# EAGLE design RPi_ADC_hat (EAGLE 6.4)

## Sheet 1 of 2
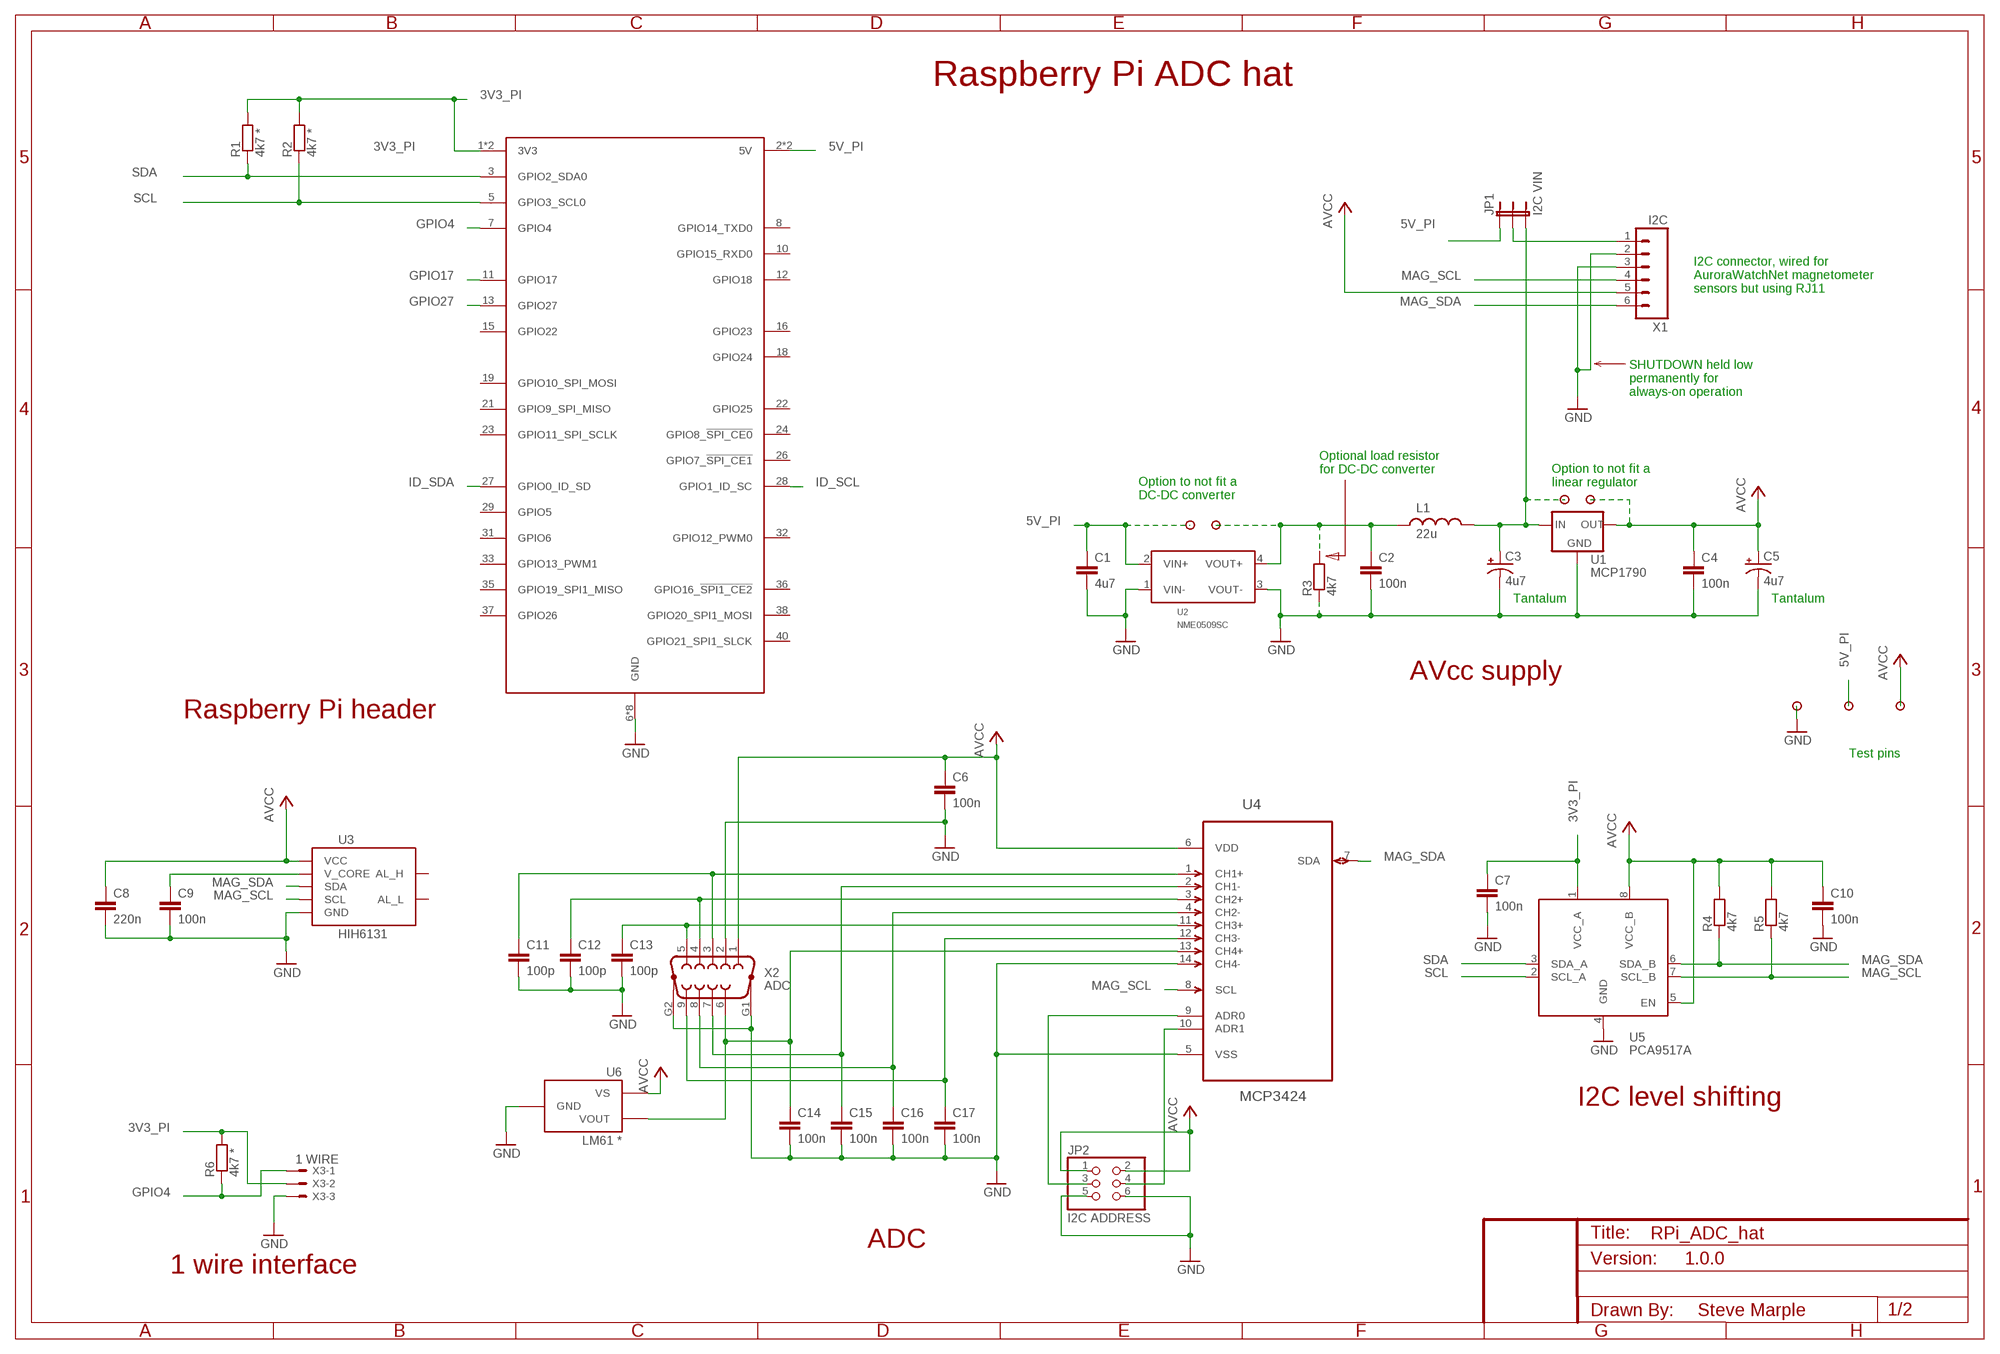
[diagram p0: schematic, sheet 1]

### Parts
C1  4u7  C-EU1206-HAND  [1206-HAND]
C2  100n  C-EU1206-HAND  [1206-HAND]
C3  4u7  CAP_POL1210-HAND  [CPOL-1210-HAND]
C4  100n  C-EU1206-HAND  [1206-HAND]
C5  4u7  CAP_POL1210-HAND  [CPOL-1210-HAND]
C6  100n  C-EU1206-HAND  [1206-HAND]
C7  100n  C-EU1206-HAND  [1206-HAND]
C8  220n  C-EU1206-HAND  [1206-HAND]
C9  100n  C-EU1206-HAND  [1206-HAND]
C10  100n  C-EU1206-HAND  [1206-HAND]
C11  100p  C-EU1206-HAND  [1206-HAND]
C12  100p  C-EU1206-HAND  [1206-HAND]
C13  100p  C-EU1206-HAND  [1206-HAND]
C14  100n  C-EU1206-HAND  [1206-HAND]
C15  100n  C-EU1206-HAND  [1206-HAND]
C16  100n  C-EU1206-HAND  [1206-HAND]
C17  100n  C-EU1206-HAND  [1206-HAND]
JP1  I2C VIN  JUMPER-3PTH  [1X03]
JP2  I2C ADDRESS  PINHD-2X3  [2X03]
L1  22u  INDUCTOR1210-HAND  [1210-HAND]
R1  4k7 *  RESISTOR1206-HAND  [1206-HAND]
R2  4k7 *  RESISTOR1206-HAND  [1206-HAND]
R3  4k7  RESISTOR1210-HAND  [1210-HAND]
R4  4k7  RESISTOR1206-HAND  [1206-HAND]
R5  4k7  RESISTOR1206-HAND  [1206-HAND]
R6  4k7 *  RESISTOR1206-HAND  [1206-HAND]
U1  MCP1790  TC1262SOT223-HAND  [SOT223-HAND]
U2  NME0509SC  DC-DC-CONV-4PIN-ISOLATINGMURATA-NME-05-12-SERIES  [DC-DC-MURATA-NME-05-12-SERIES]
U3  HIH6131  HONEYWELL-HIH613XSOIC8  [SO08]
U4  MCP3424  MCP3424-E/SLSO14  [SO14]
U5  PCA9517A  PCA9517ASOIC  [SO08]
U6  LM61 *  LM61SOT23  [SOT23-3-HAND]
U$1  PCB  RASPBERRY-PI-3  [RASPBERRY-PI-3]
U$2  PAD  [PAD]
U$3  PAD  [PAD]
U$4  PAD  [PAD]
U$5  PAD  [PAD]
U$6  PAD  [PAD]
U$7  PAD  [PAD]
U$8  PAD  [PAD]
X1  I2C  RJ11-6PTH  [RJ11-6]
X2  ADC  CONN-D9-FEMALEMULTICOMP-5504F1  [DSUB-5504F1-02-9PIN]
X3  1 WIRE  22-23-2031  [22-23-2031]

### Nets
3V3_PI [power]: C7.1 R1.2 R2.2 R6.2 U5.1(VCC_A) U$1.1(3V3) U$1.17(3V3) X3.2 ; also sheet 2
5V_PI [power]: C1.1 JP1.1 U2.2(VIN+) U$1.2(5V) U$1.4(5V) U$4.1 U$7.1 ; also sheet 2
AVCC [power]: C4.1 C5.+ C6.1 C8.1 C10.1 JP2.1 JP2.2 R4.2 R5.2 U1.3(OUT) U3.8(VCC) U4.6(VDD) U5.5(EN) U5.8(VCC_B) U6.1(VS) U$3.1 U$8.1 X1.5 X2.1
CH1+: C11.1 U4.1(CH1+) X2.3
CH1-: C15.1 U4.2(CH1-) X2.7
CH2+: C12.1 U4.3(CH2+) X2.4
CH2-: C16.1 U4.4(CH2-) X2.8
CH3+: C13.1 U4.11(CH3+) X2.5
CH3-: C17.1 U4.12(CH3-) X2.9
CH4+: C14.1 U4.13(CH4+) U6.2(VOUT) X2.6
DC-DC_OUT [power]: C3.+ JP1.3 L1.2 U1.1(IN) U$2.1
DC-DC_UNFILTERED [power]: C2.1 L1.1 R3.2 U2.4(VOUT+) U$5.1
GND [power]: C1.2 C2.2 C3.- C4.2 C5.- C6.2 C7.2 C8.2 C9.2 C10.2 C11.2 C12.2 C13.2 C14.2 C15.2 C16.2 C17.2 JP2.5 JP2.6 R3.1 U1.2(GND) U1.4(GND) U2.1(VIN-) U2.3(VOUT-) U3.2(GND) U4.5(VSS) U4.14(CH4-) U5.4(GND) U6.3(GND) U$1.6(GND) U$1.9(GND) U$1.14(GND) U$1.20(GND) U$1.25(GND) U$1.30(GND) U$1.34(GND) U$1.39(GND) U$6.1 X1.2 X1.3 X2.2 X2.G1 X2.G2 X3.3 ; also sheet 2
GPIO4: R6.1 U$1.7(GPIO4) X3.1
GPIO17: U$1.11(GPIO17) ; also sheet 2
GPIO27: U$1.13(GPIO27) ; also sheet 2
HIH_VCORE [power]: C9.1 U3.1(V_CORE)
I2C_VIN [power]: JP1.2 X1.1
ID_SCL: U$1.28(GPIO1_ID_SC) ; also sheet 2
ID_SDA: U$1.27(GPIO0_ID_SD) ; also sheet 2
MAG_SCL: R5.1 U3.3(SCL) U4.8(SCL) U5.7(SCL_B) X1.4
MAG_SDA: R4.1 U3.4(SDA) U4.7(SDA) U5.6(SDA_B) X1.6
N$6: JP2.3 U4.9(ADR0)
N$16: JP2.4 U4.10(ADR1)
SCL: R2.1 U5.2(SCL_A) U$1.5(GPIO3_SCL0)
SDA: R1.1 U5.3(SDA_A) U$1.3(GPIO2_SDA0)
Unconnected: U3.5(AL_H) U3.6(AL_L) U$1.8(GPIO14_TXD0) U$1.10(GPIO15_RXD0) U$1.12(GPIO18) U$1.15(GPIO22) U$1.16(GPIO23) U$1.18(GPIO24) U$1.19(GPIO10_SPI_MOSI) U$1.21(GPIO9_SPI_MISO) U$1.22(GPIO25) U$1.23(GPIO11_SPI_SCLK) U$1.24(GPIO8_!SPI_CE0) U$1.26(GPIO7_!SPI_CE1) U$1.29(GPIO5) U$1.31(GPIO6) U$1.32(GPIO12_PWM0) U$1.33(GPIO13_PWM1) U$1.35(GPIO19_SPI1_MISO) U$1.36(GPIO16_!SPI1_CE2) U$1.37(GPIO26) U$1.38(GPIO20_SPI1_MOSI) U$1.40(GPIO21_SPI1_SLCK)

### Notes on the sheet
- Raspberry Pi ADC hat
- I2C connector, wired for
  AuroraWatchNet magnetometer
  sensors but using RJ11
- SHUTDOWN held low
  permanently for 
  always-on operation
- Optional load resistor
  for DC-DC converter
- Option to not fit a
  linear regulator
- Option to not fit a
  DC-DC converter
- Tantalum | Tantalum
- AVcc supply
- Raspberry Pi header
- Test pins
- I2C level shifting
- ADC
- 1.0.0
- 1 wire interface
- Steve Marple

## Sheet 2 of 2
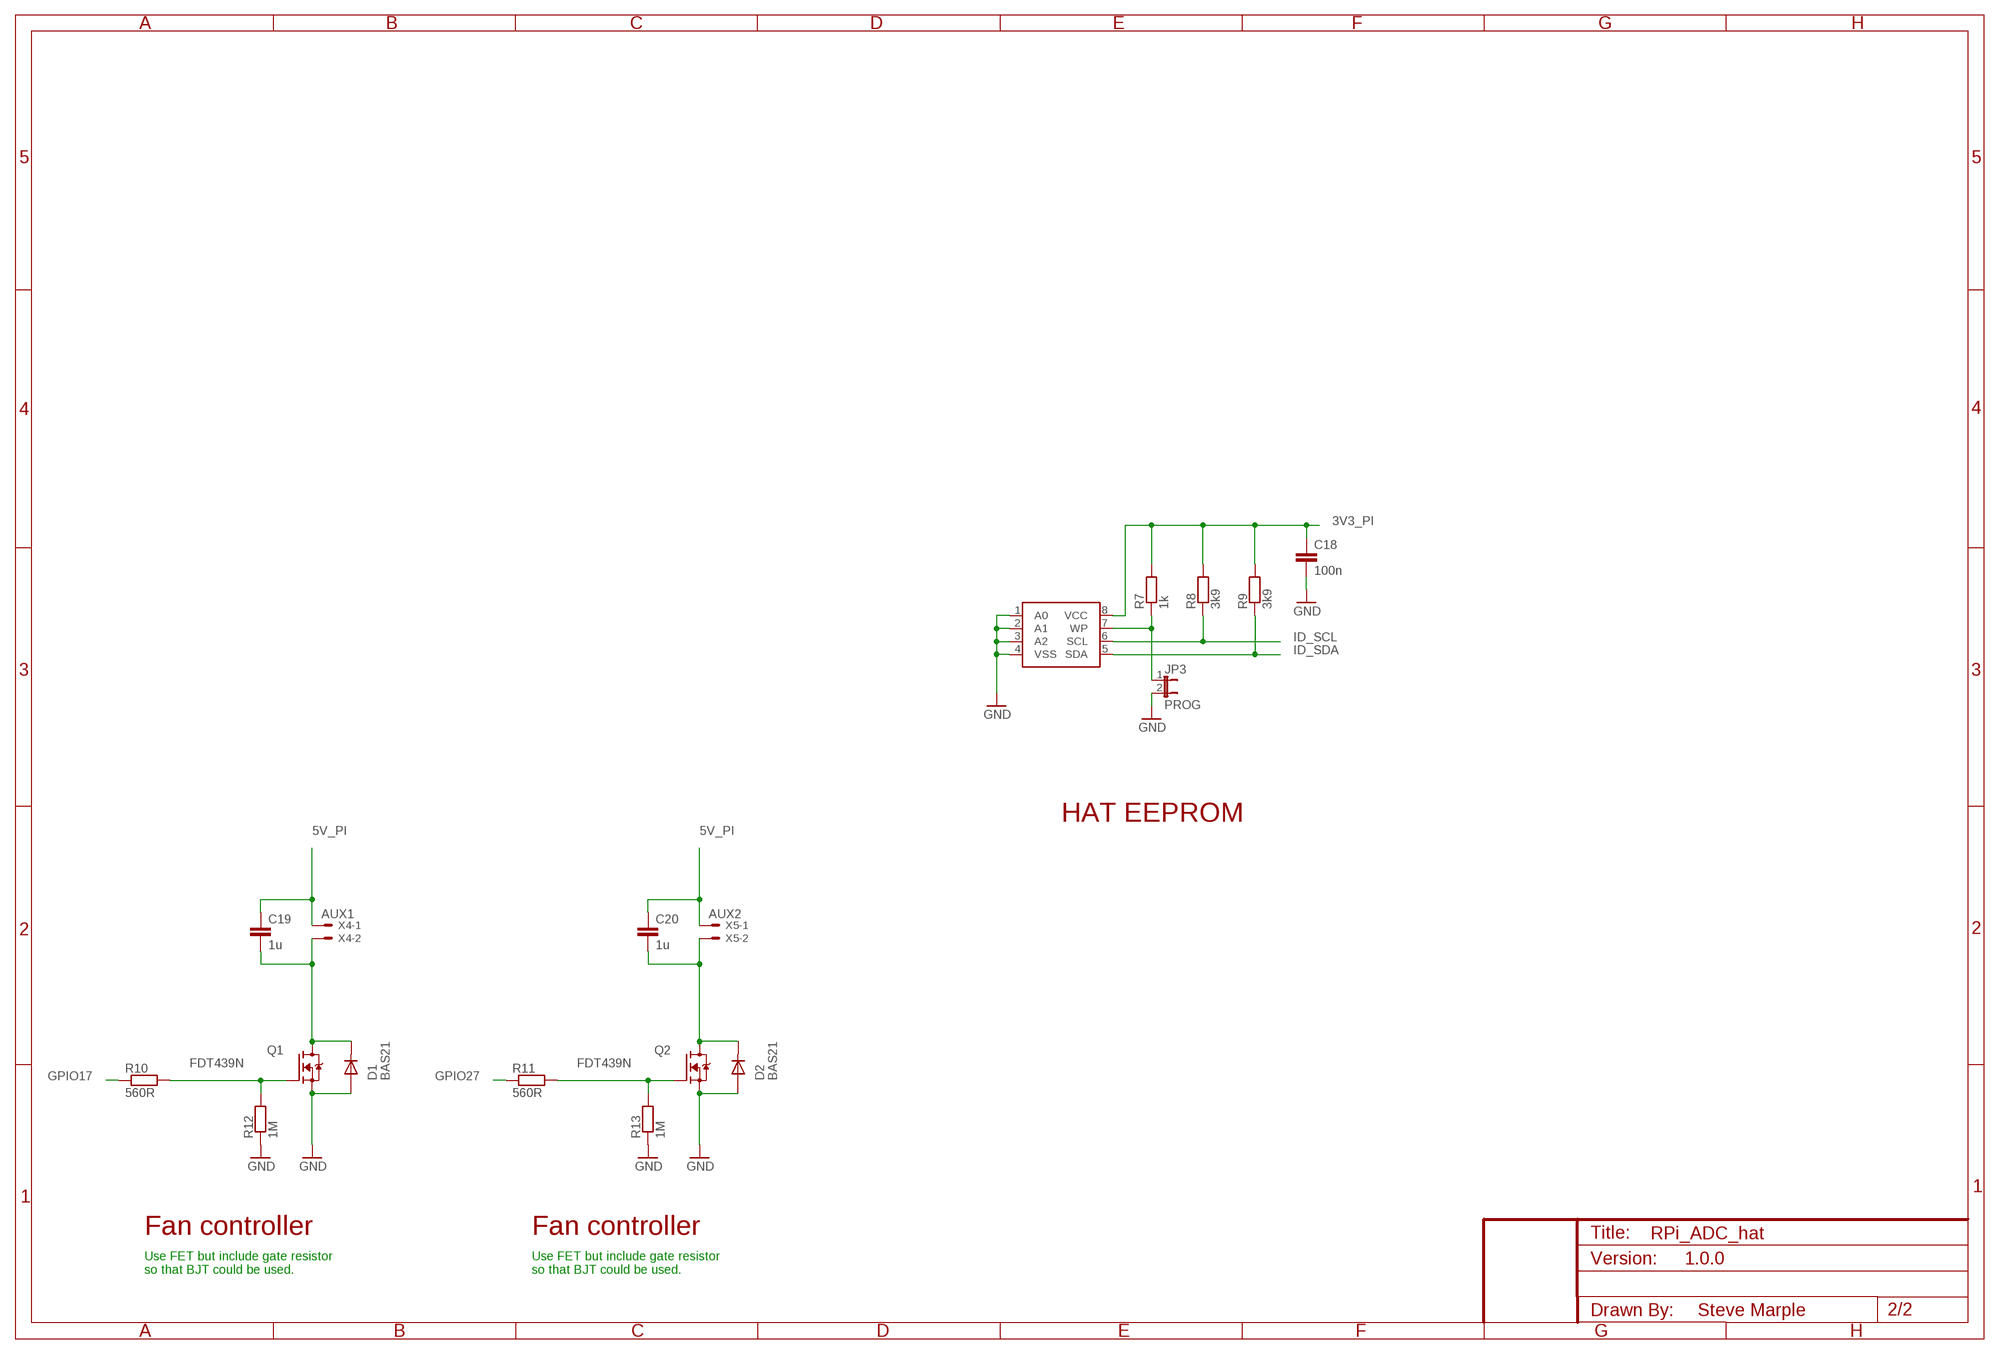
[diagram p1: schematic, sheet 2]

### Parts
C18  100n  C-EU1206-HAND  [1206-HAND]
C19  1u  C-EU1206-HAND  [1206-HAND]
C20  1u  C-EU1206-HAND  [1206-HAND]
D1  BAS21  DIODESOT23-1-3-HAND  [SOT23-3-HAND]
D2  BAS21  DIODESOT23-1-3-HAND  [SOT23-3-HAND]
JP3  PROG  JUMPER-2PTH  [1X02]
Q1  FDT439N  FET-N-TYPESOT223-HAND  [SOT223-HAND]
Q2  FDT439N  FET-N-TYPESOT223-HAND  [SOT223-HAND]
R7  1k  RESISTOR1206-HAND  [1206-HAND]
R8  3k9  RESISTOR1206-HAND  [1206-HAND]
R9  3k9  RESISTOR1206-HAND  [1206-HAND]
R10  560R  RESISTOR1206-HAND  [1206-HAND]
R11  560R  RESISTOR1206-HAND  [1206-HAND]
R12  1M  RESISTOR1206-HAND  [1206-HAND]
R13  1M  RESISTOR1206-HAND  [1206-HAND]
U7  C24C32  EEPROM-C24CXXSOIC8  [SO08]
X4  AUX1  22-23-2021  [22-23-2021]
X5  AUX2  22-23-2021  [22-23-2021]

### Nets
3V3_PI [power]: C18.1 R7.2 R8.2 R9.2 U7.8(VCC) ; also sheet 1
5V_PI [power]: C19.1 C20.1 X4.1 X5.1 ; also sheet 1
EEPROM_WP: JP3.1 R7.1 U7.7(WP)
FAN1_CTRL [power]: C19.2 D1.3(C) Q1.2(D) Q1.4(D) X4.2
FAN2_CTRL [power]: C20.2 D2.3(C) Q2.2(D) Q2.4(D) X5.2
GND [power]: C18.2 D1.1(A) D2.1(A) JP3.2 Q1.3(S) Q2.3(S) R12.1 R13.1 U7.1(A0) U7.2(A1) U7.3(A2) U7.4(VSS) ; also sheet 1
GPIO17: R10.1 ; also sheet 1
GPIO27: R11.1 ; also sheet 1
ID_SCL: R8.1 U7.6(SCL) ; also sheet 1
ID_SDA: R9.1 U7.5(SDA) ; also sheet 1
N$3: Q2.1(G) R11.2 R13.2
N$29: Q1.1(G) R10.2 R12.2

### Notes on the sheet
- HAT EEPROM
- Fan controller | Fan controller
- 1.0.0
- Use FET but include gate resistor
  so that BJT could be used.
- Use FET but include gate resistor
  so that BJT could be used.
- Steve Marple

## Library data of the parts
C1 C2 C4 C6-C20 = SteveMarple:C-EU
C3 C5 = SteveMarple:CAP_POL: Capacitor Polarized These are standard SMD and PTH capacitors. Normally 10uF, 47uF, and 100uF in electrolytic and tantalum varieties. Always verify the external diameter of the through hole cap, it varies with capacity, voltage, and manufacturer. The EIA devices should be standard.
D1 D2 = SteveMarple:DIODE
JP1 = SparkFun:JUMPER-3
JP2 = pinhead:PINHD-2X3: PIN HEADER
JP3 = SparkFun:JUMPER-2: Jumper Basic 0.1" spaced jumper. Use with breakaway headers.
L1 = SteveMarple:INDUCTOR: Inductors Basic Inductor/Choke - 0603 and 1206. Footprints are not proven and vary greatly between part numbers.
Q1 Q2 = SteveMarple:FET-N-TYPE
R1-R13 = SteveMarple:RESISTOR: 1/4W PTH resistor
U1 = SteveMarple:TC1262: Micropchip TC1262 CMOS LDO 500mA. 80uA supply current.
U2 = SteveMarple:DC-DC-CONV-4PIN-ISOLATING
U3 = SteveMarple:HONEYWELL-HIH613X
U4 = SteveMarple:MCP3424-E/SL: Analog-to-Digital Converter Footprint adapted from Eagle file from Onecall web site
U5 = SteveMarple:PCA9517A
U6 = SteveMarple:LM61
U7 = SteveMarple:EEPROM-C24CXX
U$1 = SteveMarple:RASPBERRY-PI-3
U$2-U$8 = SteveMarple:PAD
X1 = SteveMarple:RJ11-6: RJ11 Jack Simple 6 pin RJ11 jack. Commonly found on CAT3 devices and Microchip programmers. SKU: PRT-00132
X2 = SteveMarple:CONN-D9-FEMALE: SUB-D; OC_FARNELL: unknown; OC_NEWARK: unknown
X3 = SteveMarple:22-23-2031: .100" (2.54mm) Center Header - 3 Pin; MF: MOLEX; MPN: 22-23-2031; OC_FARNELL: 1462950; OC_NEWARK: 30C0862
X4 X5 = SteveMarple:22-23-2021: .100" (2.54mm) Center Header - 2 Pin; MF: MOLEX; MPN: 22-23-2021; OC_FARNELL: 1462926; OC_NEWARK: 25C3832

## Net classes
1 power: width 0.381 mm
2 5V: width 0.381 mm
3 antenna: width 0.61 mm

## Board
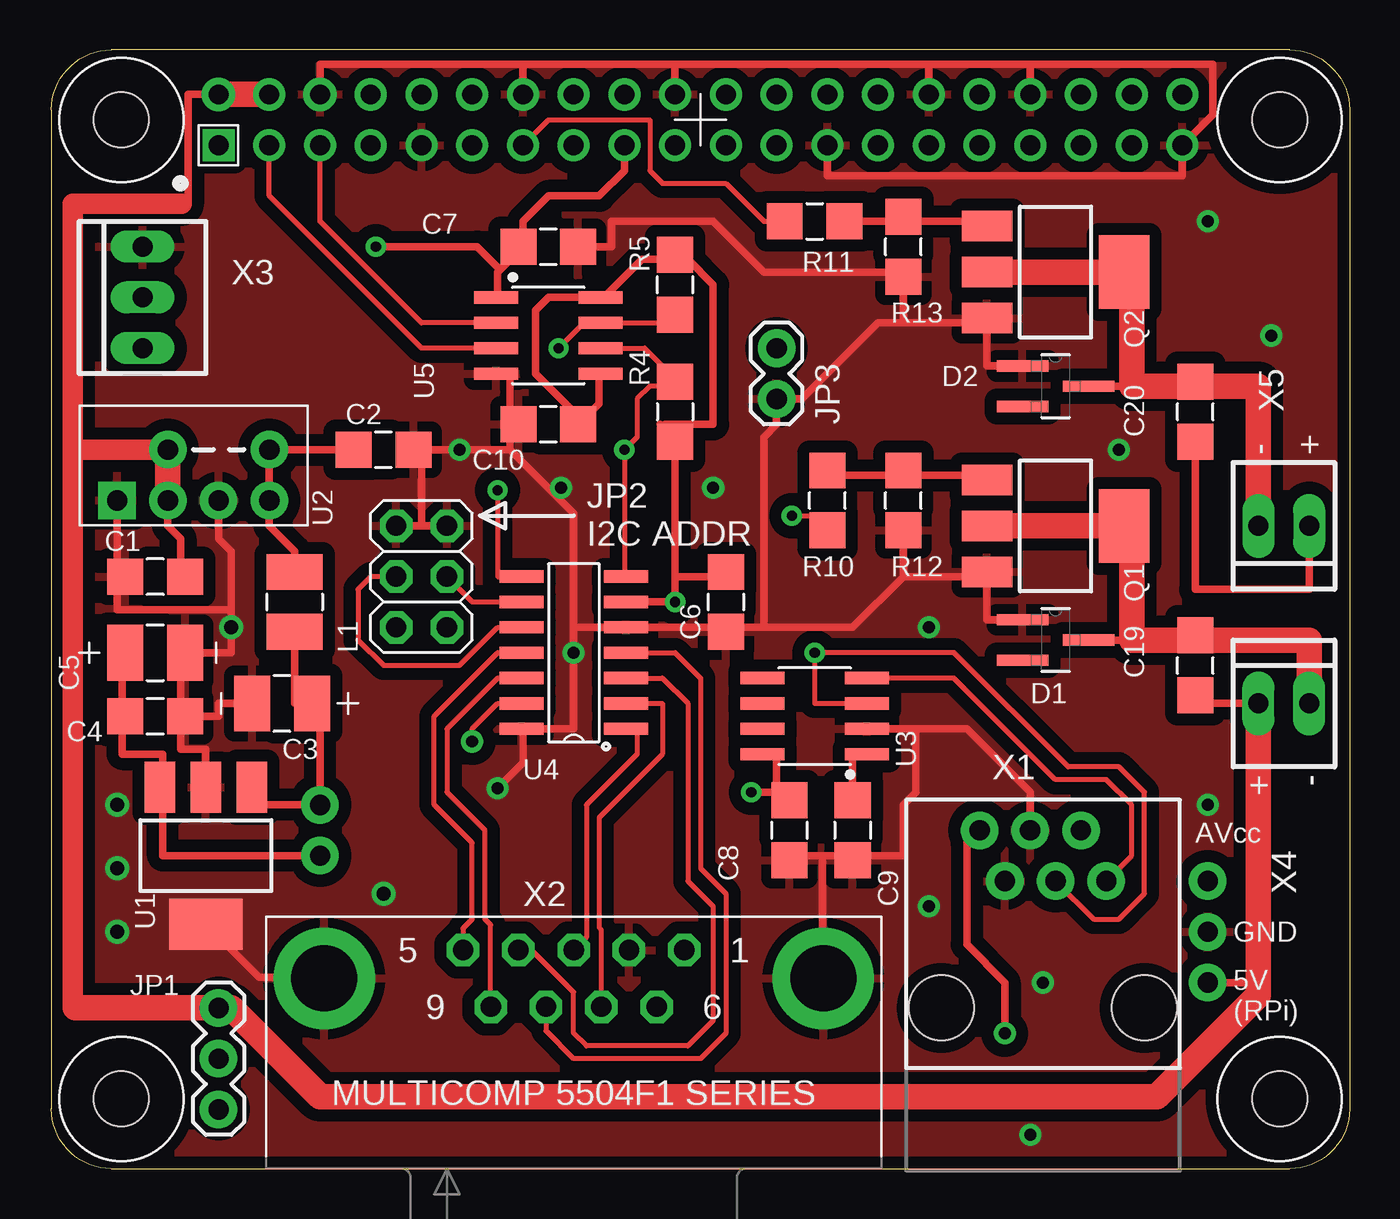
[diagram p2: board, top side]
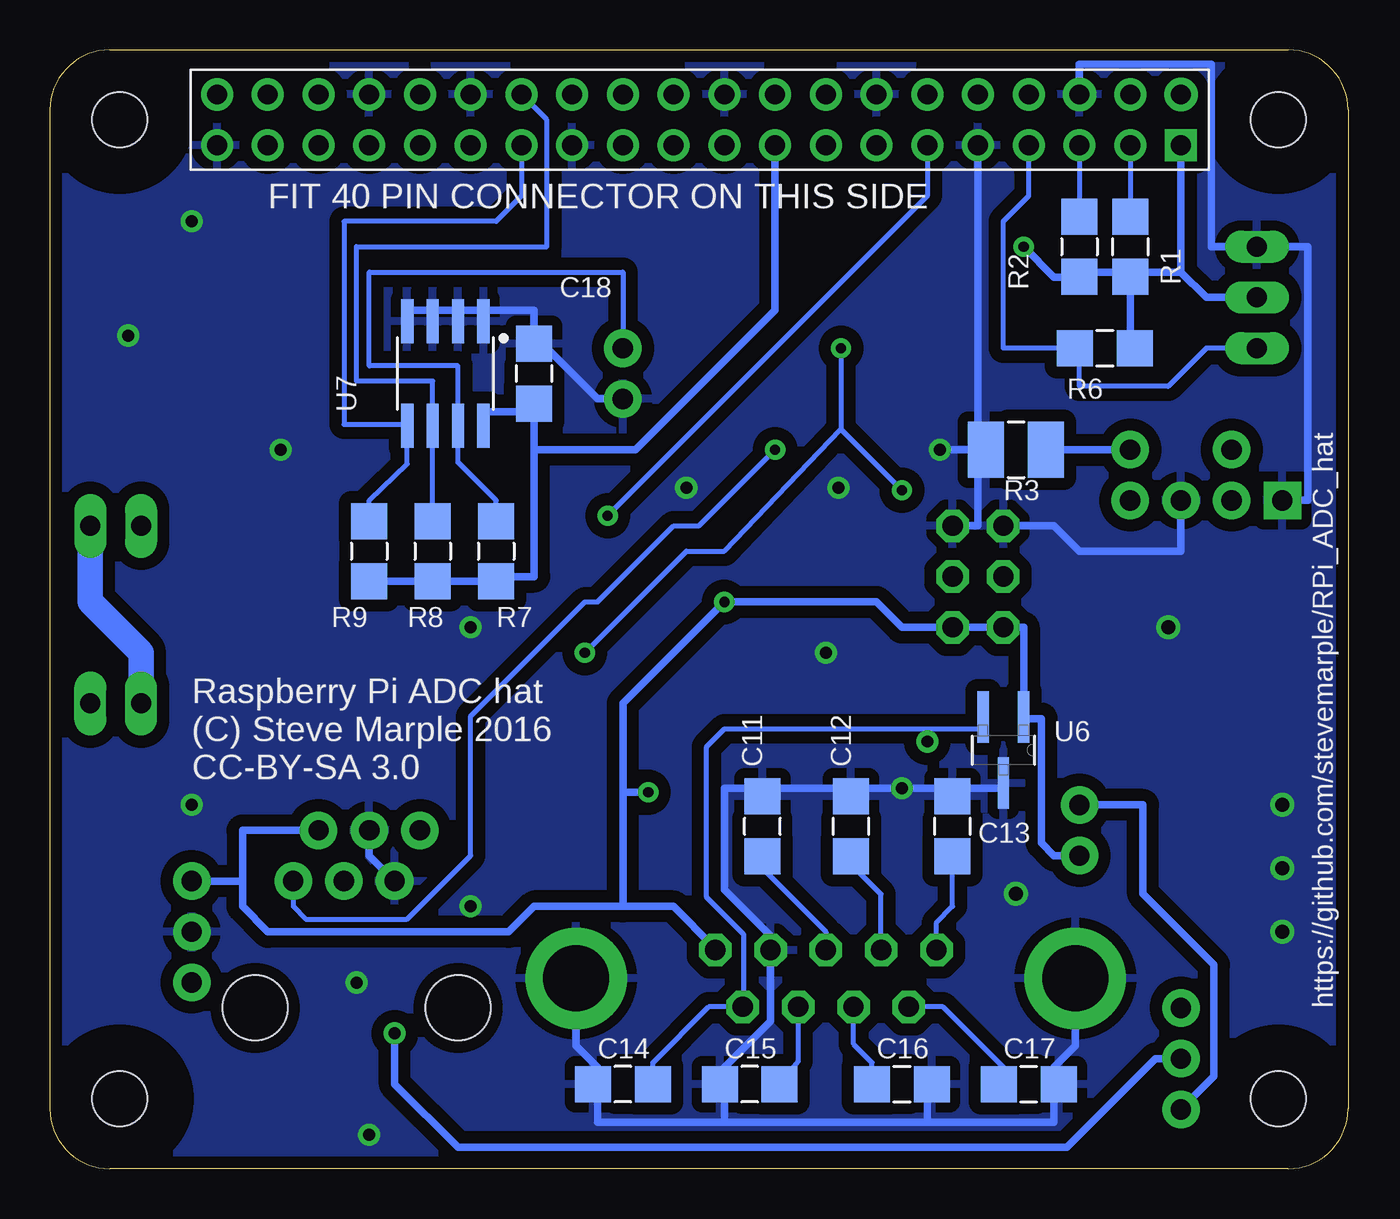
[diagram p3: board, bottom side, seen from below]

Size 65 x 56 mm. Coordinates in mm from the lower left corner, seen from the top.
Copper layers (1*16): Top 0.035mm / dielectric 1.5mm / Bottom 0.035mm
Design rules "SparkFun_Iteadstudio_10_12mil": minimum track width 10mil, minimum drill 20mil, track to track 12mil, track to pad 12mil, pad to pad 12mil, via to via 12mil, smd to smd 12mil, copper to edge 0.5mm, drill to drill 8mil, minimum pad ring 12mil, minimum via ring 10mil, stop-mask expansion 4mil, vias tented up to drill 25mil, thermal gap 20mil

### Footprints (pad centres in the part's own frame; a part is rotated, then mirrored left to right if it is on the bottom)
1206-HAND = smd 1.8 x 1.803: 1 -1.499,0; 2 1.499,0
CPOL-1210-HAND = smd 1.8 x 2.794: + -1.499,0; - 1.499,0
SOT23-3-HAND = smd 2.591 x 0.559: 1 -1.651,1.016; 2 -1.651,-1.016; 3 1.651,0
1X03 = drill 1.016 pad 1.88: 1 0,0; 2 2.54,0; 3 5.08,0
2X03 = drill 1.016 octagon: 1 -2.54,-1.27; 2 -2.54,1.27; 3 0,-1.27; 4 0,1.27; 5 2.54,-1.27; 6 2.54,1.27
1X02 = drill 1.016 pad 1.88: 1 0,0; 2 2.54,0
1210-HAND = smd 1.8 x 2.794: 1 -1.499,0; 2 1.499,0
SOT223-HAND = smd 1.524 x 2.54: 1 -2.3,-3.429; 2 0,-3.429; 3 2.3,-3.429 | smd 3.683 x 2.54: 4 0,3.429
DC-DC-MURATA-NME-05-12-SERIES = drill 1.016 pad 1.88 square: 1 -3.81,0 | drill 1.016 pad 1.88: 2 -1.27,0; 3 1.27,0; 4 3.81,0
SO08 = smd 0.61 x 2.21: 1 -1.905,-2.616; 2 -0.635,-2.616; 3 0.635,-2.616; 4 1.905,-2.616; 5 1.905,2.616; 6 0.635,2.616; 7 -0.635,2.616; 8 -1.905,2.616
SO14 = smd 0.61 x 2.21: 1 -3.81,-2.616; 2 -2.54,-2.616; 3 -1.27,-2.616; 4 0,-2.616; 5 1.27,-2.616; 6 2.54,-2.616; 7 3.81,-2.616; 8 3.81,2.616; 9 2.54,2.616; 10 1.27,2.616; 11 0,2.616; 12 -1.27,2.616; 13 -2.54,2.616; 14 -3.81,2.616
RASPBERRY-PI-3 = drill 1 square: 1 8.37,51.23 | drill 1 pad 1.676: 2 8.37,53.77; 6 13.45,53.77 | drill 1: 3 10.91,51.23; 4 10.91,53.77; 5 13.45,51.23; 7 15.99,51.23; 8 15.99,53.77; 9 18.53,51.23; 10 18.53,53.77; 11 21.07,51.23; 12 21.07,53.77; 13 23.61,51.23; 14 23.61,53.77; 15 26.15,51.23; 16 26.15,53.77; 17 28.69,51.23; 18 28.69,53.77; 19 31.23,51.23; 20 31.23,53.77; 21 33.77,51.23; 22 33.77,53.77; 23 36.31,51.23; 24 36.31,53.77; 25 38.85,51.23; 26 38.85,53.77; 27 41.39,51.23; 28 41.39,53.77; 29 43.93,51.23; 30 43.93,53.77; 31 46.47,51.23; 32 46.47,53.77; 33 49.01,51.23; 34 49.01,53.77; 35 51.55,51.23; 36 51.55,53.77; 37 54.09,51.23; 38 54.09,53.77; 39 56.63,51.23; 40 56.63,53.77 | hole 2.75: 3.5,3.5; 3.5,52.5; 61.5,52.5; 61.5,3.5
PAD = drill 1.016 pad 1.88: 1 0,0
RJ11-6 = drill 1.016 pad 1.88: 1 1.905,8.89; 2 3.175,6.35; 3 4.445,8.89; 4 5.715,6.35; 5 6.985,8.89; 6 8.255,6.35 | hole 3.251: 0,0; 10.16,0
DSUB-5504F1-02-9PIN = drill 1.016 octagon: 1 -5.54,-1.42; 2 -2.77,-1.42; 3 0,-1.42; 4 2.77,-1.42; 5 5.54,-1.42; 6 -4.155,1.42; 7 -1.385,1.42; 8 1.385,1.42; 9 4.155,1.42 | drill 3.302 pad 5.08: G1 -12.495,0; G2 12.495,0
22-23-2031 = drill 1 long: 1 -2.54,0; 2 0,0; 3 2.54,0
22-23-2021 = drill 1 long: 1 -1.27,0; 2 1.27,0

### Placement (x,y rotation side)
C1  5.2,29.64 180 top
C2  16.62,35.99 0 top
C3  11.54,23.29 180 top
C4  5.2,22.66 0 top
C5  5.2,25.83 0 top
C6  33.77,28.37 270 top
C7  24.88,46.15 0 top
C8  36.95,16.94 270 top
C9  40.12,16.94 270 top
C10  24.88,37.26 180 top
C11  29.32,17.14 90 bottom
C12  24.88,17.14 90 bottom
C13  19.8,17.14 90 bottom
C14  36.31,4.24 180 bottom
C15  29.96,4.24 180 bottom
C16  22.34,4.24 0 bottom
C17  15.99,4.24 0 bottom
C18  40.76,39.8 90 bottom
C19  57.27,25.2 90 top
C20  57.27,37.9 90 top
D1  50.28,26.46 0 top
D2  50.28,39.16 0 top
JP1  8.37,8.05 270 top
JP2  18.53,29.64 90 top
JP3  36.31,41.07 270 top
L1  12.18,28.37 270 top
Q1  50.28,32.18 270 top
Q2  50.28,44.88 270 top
R1  10.91,46.15 270 bottom
R2  13.45,46.15 270 bottom
R3  16.62,35.99 0 bottom
R4  31.23,37.9 270 top
R5  31.23,44.24 90 top
R6  12.18,41.07 0 bottom
R7  42.66,30.91 270 bottom
R8  45.84,30.91 270 bottom
R9  49.01,30.91 270 bottom
R10  38.85,33.45 90 top
R11  38.22,47.42 0 top
R12  42.66,33.45 90 top
R13  42.66,46.15 90 top
U1  7.74,15.67 180 top
U2  7.1,33.45 0 top
U3  38.22,22.66 90 top
U4  26.15,25.83 90 top
U5  24.88,41.7 270 top
U6  17.26,20.95 270 bottom
U7  45.2,39.8 180 bottom
U$1  0,0 0 top
U$2  13.45,18.21 0 top
U$3  13.45,15.67 0 top
U$4  5.83,35.99 0 top
U$5  10.91,35.99 0 top
U$6  57.9,11.86 0 top
U$7  57.9,9.32 0 top
U$8  57.9,14.4 0 top
X1  44.56,8.05 0 top
X2  26.15,9.53 180 top
X3  4.56,43.61 90 top
X4  61.71,23.29 0 top
X5  61.71,32.18 180 top

### Tracks (layer width: path | path; a pad name or v marks a point on that pad's centre or on a via)
3V3_PI  (via drill 0.51)
  Top 0.381: U5.1 22.34,43.61 22.34,44.88 22.47,45.01 | 22.47,45.01 23.61,46.15 C7.1 23.61,46.38 23.61,47.42 24.88,48.69 27.42,48.69 28.69,49.96 U$1.17 | 22.47,45.01 21.32,46.15 v16.24,46.15
  Bottom 0.381: U$1.1 8.37,44.88 | 8.37,44.88 10.91,44.88 | 10.91,44.88 13.45,44.88 R2.2 13.45,44.63 14.72,44.63 v16.24,46.15 | 10.91,44.88 R1.2 10.91,41.07 R6.2 | 8.37,44.88 7.1,43.61 X3.2 | R9.2 R8.2 R7.2 42.66,29.64 40.76,29.64 40.76,35.99 | 40.76,35.99 40.76,37.9 | 40.76,37.9 C18.1 | U7.8 43.3,37.9 40.76,37.9 | U$1.17 28.69,42.98 35.67,35.99 40.76,35.99
5V_PI
  Top 0.381: C19.1 57.27,23.29 X4.1 | C20.1 57.27,29 62.98,29 X5.1 | U$1.2 6.85,53.77 6.85,48.31 6.53,48.31 | 1.07,8.05 1.2,8.05 | U2.2 5.83,32.18 6.46,31.54 6.46,29.64 C1.1 6.59,29.64 | U$7.1 60.44,9.32
  Top 1.016: 6.53,48.31 1.07,48.31 1.07,35.99 | U$4.1 1.07,35.99 | 1.07,8.05 1.07,35.99
  Top 1.27: U$1.4 U$1.2 | 1.2,8.05 JP1.1 9.01,8.05 13.45,3.6 55.36,3.6 60.44,8.69 60.44,9.32 X4.1 | U$4.1 U2.2
  Bottom 1.27: X4.1 60.44,25.83 62.98,28.37 X5.1
AVCC  (via drill 0.51)
  Top 0.381: C6.1 33.77,29.64 31.23,29.64 | 31.23,29.64 v31.23,28.37 U4.6 | U5.5 27.5,39.88 27.42,39.8 27.42,38.3 C10.1 26.15,37.26 26.15,37.9 24.25,39.8 24.25,42.98 24.88,43.61 U5.8 27.67,43.61 29.58,45.52 31.1,45.52 | 3.54,22.66 3.54,25.83 C5.+ | 3.54,22.66 C4.1 3.54,22.53 | 3.54,22.53 3.54,20.75 5.58,20.75 5.58,19.48 U1.3 5.58,18.97 5.58,15.67 U$3.1 | 3.54,22.53 3.54,22.66 | 31.1,45.52 31.23,45.64 R5.2 31.23,45.39 31.1,45.52 | 30.47,37.26 31.23,36.5 R4.2 | 31.23,29.64 R4.2 | 31.1,45.52 31.86,45.52 33.13,44.24 33.13,37.26 30.72,37.26 R4.2 | 36.31,18.84 36.31,20.75 U3.8 | v35.04,18.84 36.31,18.84 | 36.31,18.84 C8.1 36.31,18.21 36.44,18.34
  Bottom 0.381: U$3.1 14.72,15.67 15.36,16.3 15.36,22.53 16.24,22.53 U6.1 16.24,27.1 JP2.2 JP2.1 22.34,27.1 23.61,28.37 v31.23,28.37 36.31,23.29 36.31,18.84 | 36.31,13.13 33.77,13.13 31.74,11.1 X2.1 | 36.31,13.13 36.31,18.84 | X1.5 55.36,16.94 55.36,14.4 | 55.36,14.4 55.36,13.13 54.09,11.86 42.02,11.86 40.76,13.13 36.31,13.13 | v35.04,18.84 36.31,18.84 | 55.36,14.4 U$8.1
CH1+
  Top 0.254: 28.69,22.02 U4.1 29.32,22.02 29.32,20.75 26.79,18.21 26.79,11.58 X2.3
  Bottom 0.254: C11.1 29.32,15.04 26.15,11.86 X2.3
CH1-
  Top 0.254: U4.2 30.59,23.29 30.59,20.75 27.42,17.57 27.42,12.06 27.54,11.95 X2.7
  Bottom 0.254: X2.7 27.54,5.37 C15.1
CH2+
  Top 0.254: U4.3 30.59,24.56 31.86,23.29 31.86,14.4 33.13,13.13 33.13,7.42 31.86,6.14 26.79,6.14 26.15,6.78 26.15,8.84 24.04,10.95 X2.4
  Bottom 0.254: C12.1 24.88,15.24 23.38,13.74 X2.4
CH2-
  Top 0.254: U4.4 31.23,25.83 32.5,24.56 32.5,15.04 33.77,13.77 33.77,6.78 32.5,5.51 26.15,5.51 24.77,6.89 X2.8
  Bottom 0.254: C16.1 23.84,5.31 24.77,6.23 X2.8
CH3+
  Top 0.254: U4.11 22.34,25.83 19.16,22.66 19.16,18.21 21.07,16.3 21.07,12.49 20.61,12.04 X2.5
  Bottom 0.254: X2.5 20.61,12.32 19.8,13.13 C13.1
CH3-
  Top 0.254: U4.12 22.34,24.56 19.8,22.02 19.8,18.84 21.7,16.94 21.7,12.49 22,12.21 X2.9
  Bottom 0.254: C17.1 17.26,4.67 17.26,5.08 20.29,8.11 X2.9
CH4+  (via drill 0.6)
  Top 0.254: v21.07,21.38 21.07,22.02 22.34,23.29 U4.13
  Bottom 0.254: 21.07,22.02 31.23,22.02 32.12,21.13 32.12,13.59 30.27,11.73 30.27,8.11 X2.6 32.02,8.11 34.81,5.31 C14.1 | v21.07,21.38 21.07,22.02 | 21.07,22.02 18.15,22.02 18.15,22.61 U6.2
DC-DC_OUT
  Top 0.381: L1.2 12.18,23.29 C3.+ 13.45,23.29 U$2.1 10.28,18.21 10.15,18.97 U1.1
  Bottom 0.381: JP1.3 6.72,4.62 6.72,10.21 10.28,13.77 10.28,18.21 U$2.1
DC-DC_UNFILTERED
  Top 0.381: R3.2 U$5.1 U2.4 10.91,32.18 12.18,30.91 L1.1
  Bottom 0.381: R3.2 U$5.1
EEPROM_WP
  Bottom 0.254: R7.1 42.66,33.45 44.56,35.35 U7.7 44.56,40.18 49.01,40.18 49.01,44.88 36.31,44.88 JP3.1
FAN1_CTRL
  Top 0.381: 54.09,26.46 D1.3 | Q1.4 54.09,32.18 | C19.2 57.27,26.46
  Top 1.27: 54.09,32.18 54.09,26.46 57.27,26.46 62.98,26.46 X4.2 | Q1.2 Q1.4
FAN2_CTRL
  Top 0.381: Q2.4 54.09,44.88 | 54.09,39.16 D2.3 | 57.27,39.16 C20.2
  Top 1.27: Q2.4 Q2.2 | 54.09,44.88 54.09,39.16 57.27,39.16 60.44,39.16 X5.2
GND  (via drill 0.6, 0.7)
  Top 0.381: 33.77,27.1 U4.5 26.15,27.1 | 22.98,37.26 22.98,39.8 U5.4 | 22.98,37.26 C10.2 23.61,37.26 | 26.15,45.52 26.15,45.92 C7.2 | U4.14 23.61,22.02 | 23.61,22.02 23.61,20.32 v22.34,19.05 | 23.61,22.02 26.15,22.02 26.15,27.1 | Q2.3 47.74,42.34 | 42.66,42.34 R13.1 42.43,44.88 35.67,44.88 33.13,47.42 28.05,47.42 28.05,46.15 C7.2 | 42.66,42.34 46.47,42.34 Q2.3 | D2.1 46.85,40.18 Q2.3 | D1.1 46.85,27.48 Q1.3 46.85,29.64 42.66,29.64 | 42.66,29.64 R12.1 | 43.3,22.02 U3.2 | X1.3 49.01,18.84 45.84,22.02 43.3,22.02 | 40.12,15.67 38.6,15.67 | 38.6,15.67 36.31,15.67 C8.2 | 38.6,15.67 38.6,9.32 X2.G1 | U1.4 7.86,12.11 10.4,9.57 13.45,9.57 X2.G2 | 42.66,29.64 40.12,27.1 35.67,27.1 | 33.77,27.1 35.67,27.1 | 33.77,27.1 C6.2 | 35.67,27.1 35.67,36.62 36.31,37.26 JP3.2 37.58,38.53 41.39,42.34 42.66,42.34 | 43.3,22.02 43.3,18.84 42.66,18.21 42.66,15.67 40.12,15.67 | 40.12,15.67 C9.2 | U$1.25 38.85,49.71 56.63,49.71 U$1.39 58.15,52.75 58.15,55.29 49.01,55.29 | 49.01,55.29 43.93,55.29 | U$1.34 49.01,55.29 | 23.61,55.29 U$1.14 | 31.23,55.29 23.61,55.29 | U$1.20 31.23,55.29 | U$1.6 13.45,55.29 23.61,55.29 | 43.93,55.29 U$1.30 | 31.23,55.29 43.93,55.29 | 18.53,32.18 18.53,35.99 | JP2.5 18.53,32.18 | 18.53,32.18 JP2.6 | 18.53,35.99 22.98,35.99 | R3.1 18.53,35.99 | 22.98,35.99 22.98,37.26 | 7.86,19.23 U1.2 7.74,21 6.46,21 6.46,22.66 | 6.46,22.66 6.46,25.83 C5.- 9.01,25.83 9.01,27.99 | 6.46,22.66 C4.2 8.37,22.66 8.37,23.29 C3.- | 9.01,27.99 9.01,30.91 8.37,31.54 U2.3 | U2.1 3.29,29.64 | 9.01,27.99 3.29,27.99 3.29,29.64 | 3.29,29.64 C1.2 | 26.15,27.1 26.15,32.81 22.98,35.99 | 26.15,46.15 C7.2
  Bottom 0.381: 14.72,4.44 14.72,2.33 21.07,2.33 | 21.07,2.33 31.23,2.33 | 31.23,2.33 31.23,4.22 C15.2 31.46,4.85 28.92,7.39 X2.2 28.92,11.66 31.23,13.97 31.23,19.05 29.32,19.05 | C16.2 21.07,4.44 21.07,2.33 | 31.23,2.33 37.58,2.33 37.58,4.44 | 24.88,19.05 v22.34,19.05 19.8,19.05 | C12.2 24.88,19.05 | 24.88,19.05 29.32,19.05 | 29.32,19.05 C11.2 | C13.2 19.8,19.05 | 19.8,19.05 17.26,19.05 U6.3 | C17.2 14.72,4.44 | 14.72,4.44 14.72,5.08 13.65,6.14 X2.G2 | X2.G1 38.65,6.14 37.58,5.08 37.58,4.44 | 37.58,4.44 C14.2 | X1.2 49.01,15.67 X1.3 | 18.53,35.99 18.53,32.18 JP2.5 | 18.53,35.99 U$1.9 | U2.1 2.02,33.45 2.02,46.15 X3.3 6.85,46.15 6.85,55.29 13.45,55.29 U$1.6 | JP2.6 14.72,32.18 13.45,30.91 8.37,30.91 U2.3 | 43.3,42.98 40.76,42.98 C18.2 40.53,41.07 40.12,41.07 37.58,38.53 JP3.2 | U7.1 43.3,42.98 | 43.3,42.98 44.56,42.98 | 45.84,42.98 44.56,42.98 | 44.56,42.98 U7.2 | U7.4 47.1,42.98 45.84,42.98 | 45.84,42.98 U7.3 | R3.1 18.53,35.99 | 18.53,35.99 v20.43,35.99
  other vias: 26.15,25.83 3.29,18.21 3.29,11.86 16.62,13.77 43.93,27.1 49.65,9.32 57.9,18.21 61.08,41.7 57.9,47.42 25.52,34.09 43.93,13.13 9.01,27.1 3.29,15.04 53.45,35.99 33.13,34.09 49.01,1.7
  pour Top (isolate 0.61, rank 2): 68.06,-3.38 68.06,57.58 -5.6,57.58 -5.6,-3.38
  pour Bottom (isolate 0.61): 70.6,-5.92 70.6,60.12 -4.33,60.12 -4.33,-5.92
GPIO4
  Bottom 0.254: X3.1 7.1,41.07 9.01,39.16 13.45,39.16 13.45,40.84 R6.1 17.26,41.07 17.26,47.42 15.99,48.69 U$1.7
GPIO17  (via drill 0.51)
  Top 0.254: v37.07,32.69 38.34,32.69 38.85,32.18 R10.1
  Bottom 0.254: v37.07,32.69 21.07,48.69 U$1.11
GPIO27
  Top 0.254: R11.1 35.67,47.42 33.77,49.33 30.59,49.33 29.96,49.96 29.96,52.5 24.88,52.5 U$1.13
HIH_VCORE
  Top 0.381: C9.1 40.12,20.75 U3.1
I2C_VIN  (via drill 0.6)
  Top 0.381: X1.1 45.84,16.3 45.84,11.22 47.74,9.32 v47.74,6.78
  Bottom 0.381: JP1.2 9.64,5.51 14.09,1.06 44.56,1.06 47.74,4.24 v47.74,6.78
ID_SCL
  Bottom 0.254: R8.1 U7.6 45.84,39.42 49.65,39.42 49.65,46.15 40.12,46.15 40.12,52.5 U$1.28
ID_SDA
  Bottom 0.254: R9.1 49.01,33.45 47.1,35.28 U7.5 47.1,37.26 50.28,37.26 50.28,47.42 42.66,47.42 41.39,48.69 U$1.27
MAG_SCL  (via drill 0.51)
  Top 0.254: R5.1 31.23,42.59 30.98,42.34 U5.7 26.66,42.34 v25.39,41.07 | v22.34,33.96 22.34,29.64 U4.8 | U3.3 38.22,23.29 v38.22,25.83 45.2,25.83 50.91,20.11 53.45,20.11 54.73,18.84 54.73,13.77 53.45,12.49 52.19,12.49 X1.4
  Bottom 0.254: 25.39,37.01 v22.34,33.96 | v25.39,41.07 25.39,37.01 | v38.22,25.83 33.13,30.91 31.23,30.91 25.39,37.01
MAG_SDA  (via drill 0.51)
  Top 0.254: 30.98,39.8 29.71,41.07 U5.6 | 30.98,39.8 31.23,39.55 R4.1 30.98,39.8 | 30.98,39.8 30.59,39.16 29.96,39.16 29.32,38.53 29.32,36.62 v28.69,35.99 28.69,29.64 U4.7 | U3.4 45.2,24.56 50.28,19.48 52.82,19.48 54.09,18.21 54.09,15.67 X1.6
  Bottom 0.254: v28.69,35.99 32.5,32.18 33.77,32.18 37.58,28.37 38.22,28.37 43.93,22.66 43.93,15.67 47.1,12.49 52.19,12.49 52.82,13.13 X1.6
N$3
  Top 0.381: R11.2 42.66,47.42 | R13.2 42.66,47.42 | 42.66,47.42 46.47,47.42 46.47,47.18 Q2.1
N$6
  Top 0.254: U4.9 21.07,28.37 JP2.3
N$16
  Top 0.254: U4.10 22.34,27.1 20.43,25.2 16.62,25.2 15.36,26.46 15.36,29 15.99,29.64 JP2.4
N$29
  Top 0.381: R10.2 38.85,34.72 42.66,34.72 | R12.2 42.66,34.72 | 42.66,34.72 46.47,34.72 46.47,34.48 Q1.1
SCL
  Top 0.254: U5.2 18.53,42.34 13.45,47.42 U$1.5
  Bottom 0.254: U$1.5 R2.1
SDA
  Top 0.254: U5.3 18.53,41.07 10.91,48.69 U$1.3
  Bottom 0.254: U$1.3 R1.1

### Text on the board
_tsilk: - | + | I2C ADDR | + | - | AVcc | GND | 5V / (RPi)
_bsilk: FIT 40 PIN CONNECTOR ON THIS SIDE | Raspberry Pi ADC hat | (C) Steve Marple 2016 | CC-BY-SA 3.0 | https://github.com/stevemarple/RPi_ADC_hat